# EAGLE board CubePCB (EAGLE 8.3.2), part 1 of 2
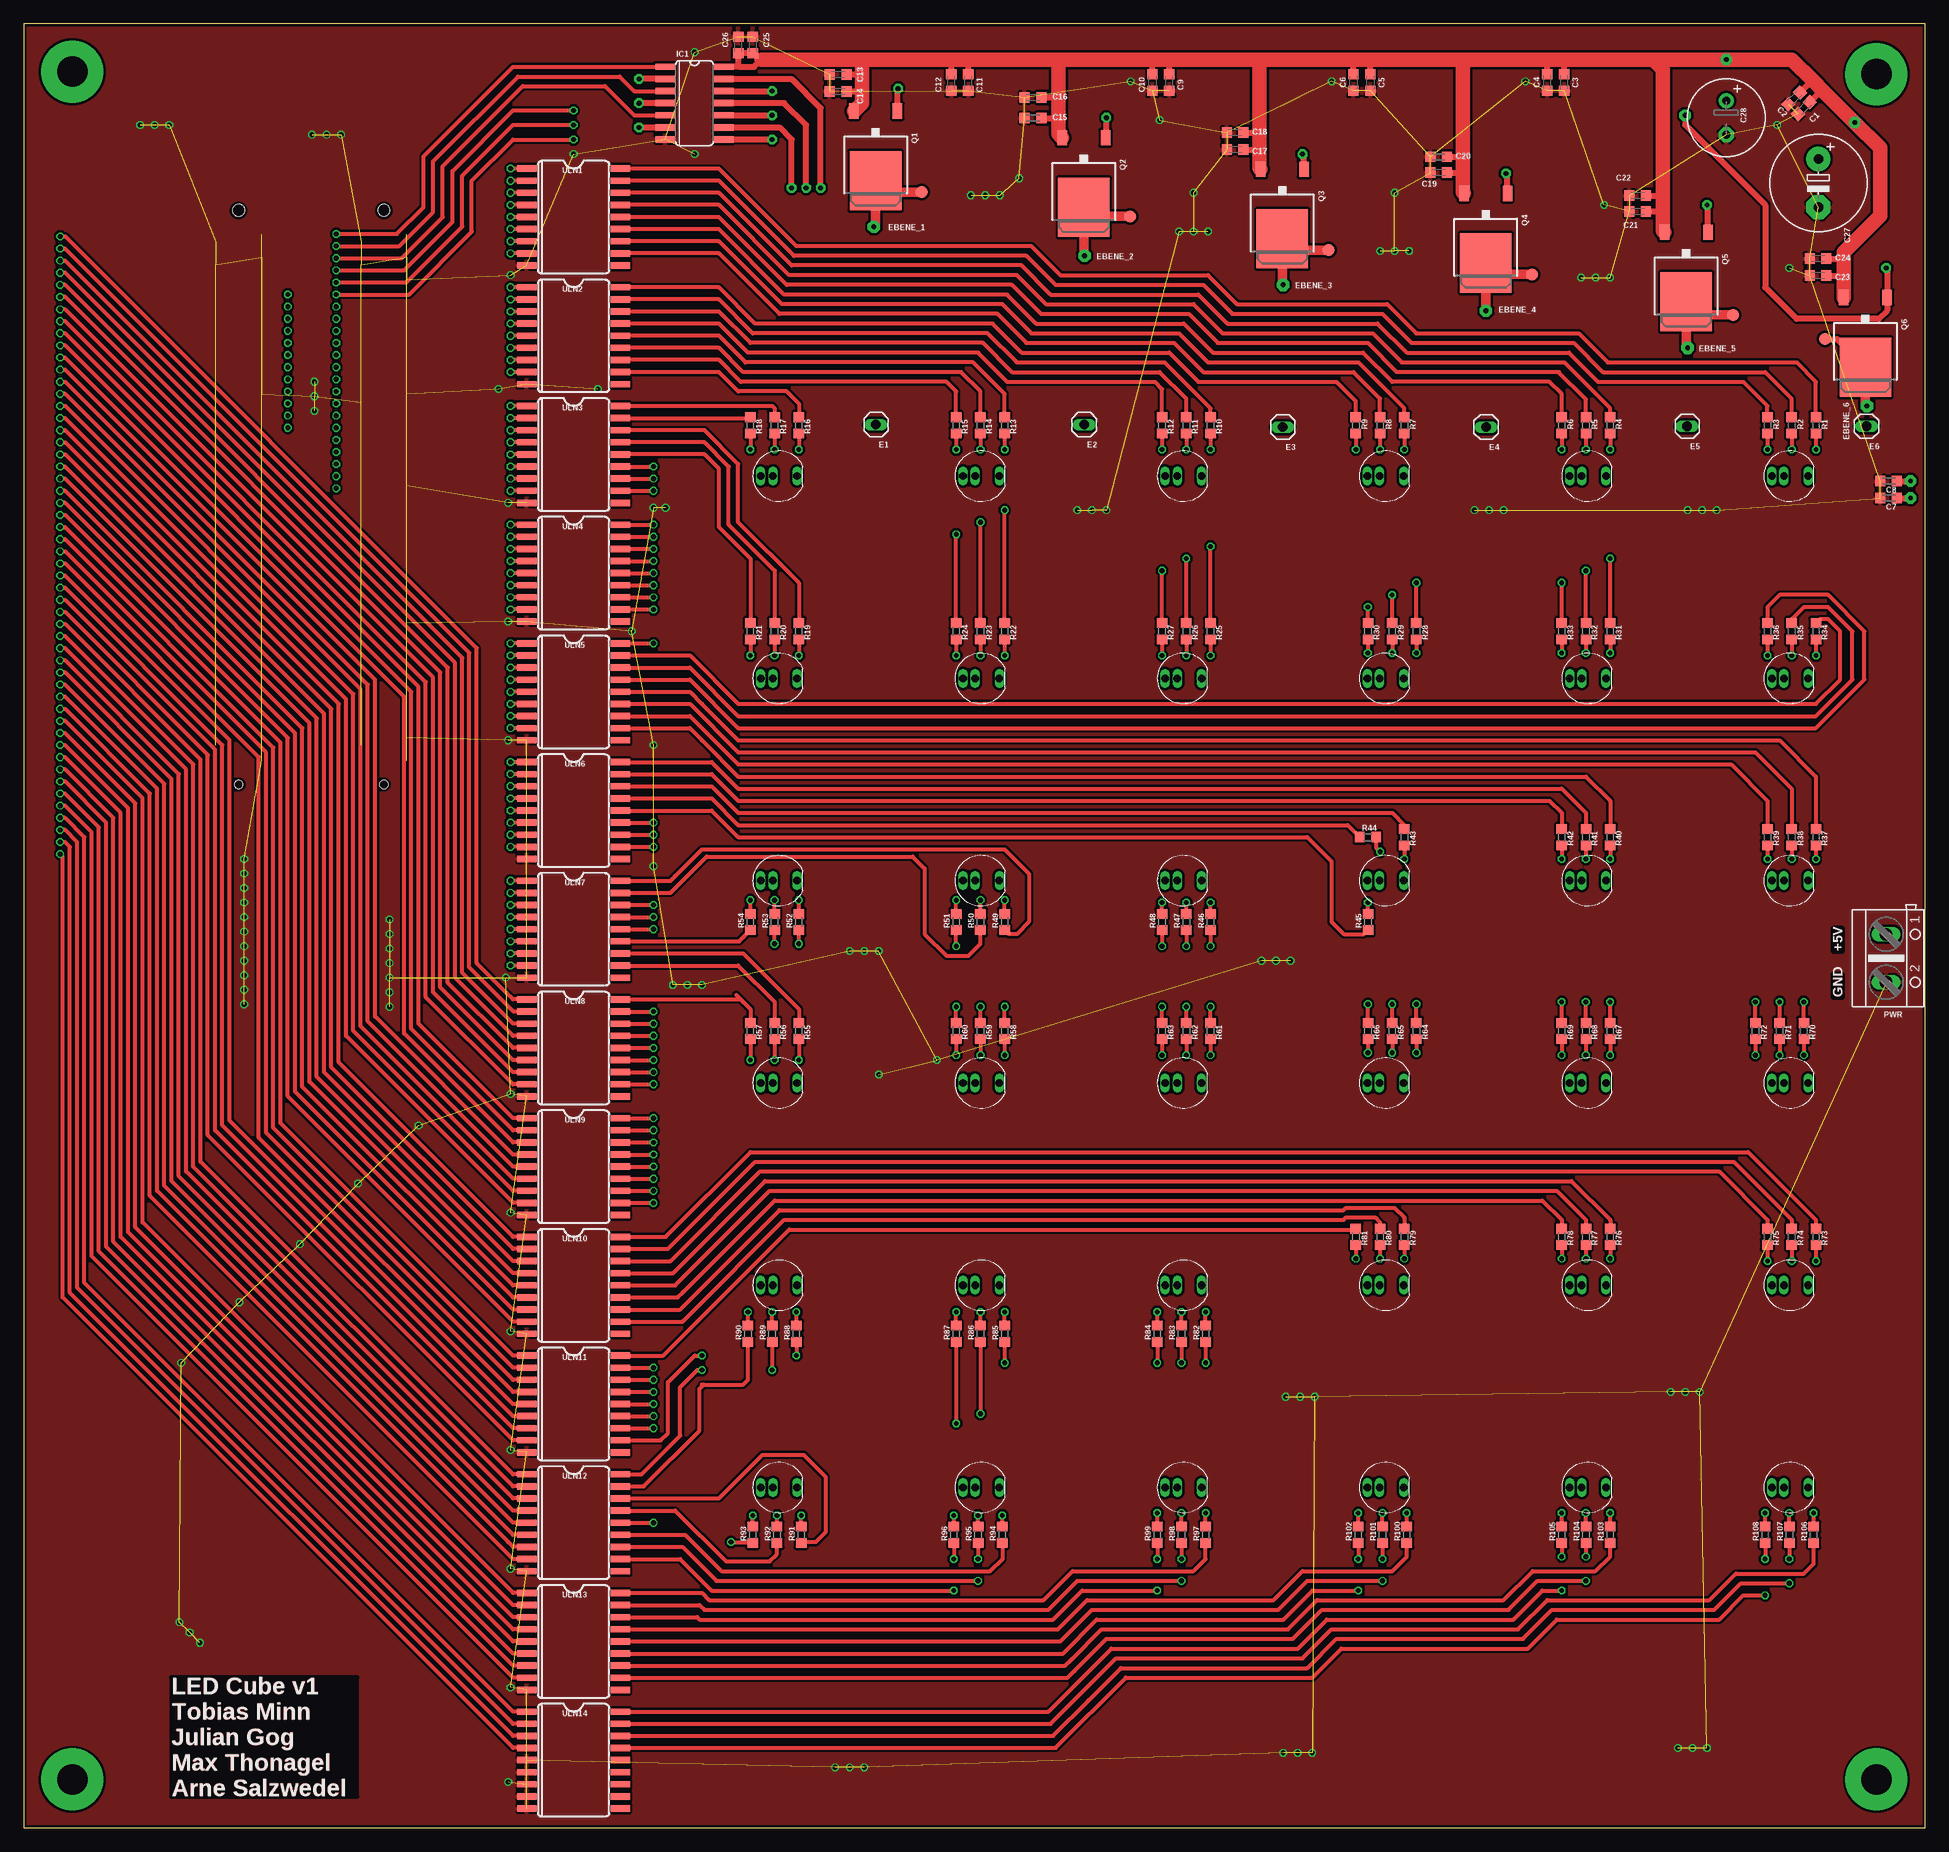
[diagram p4: board, top side]
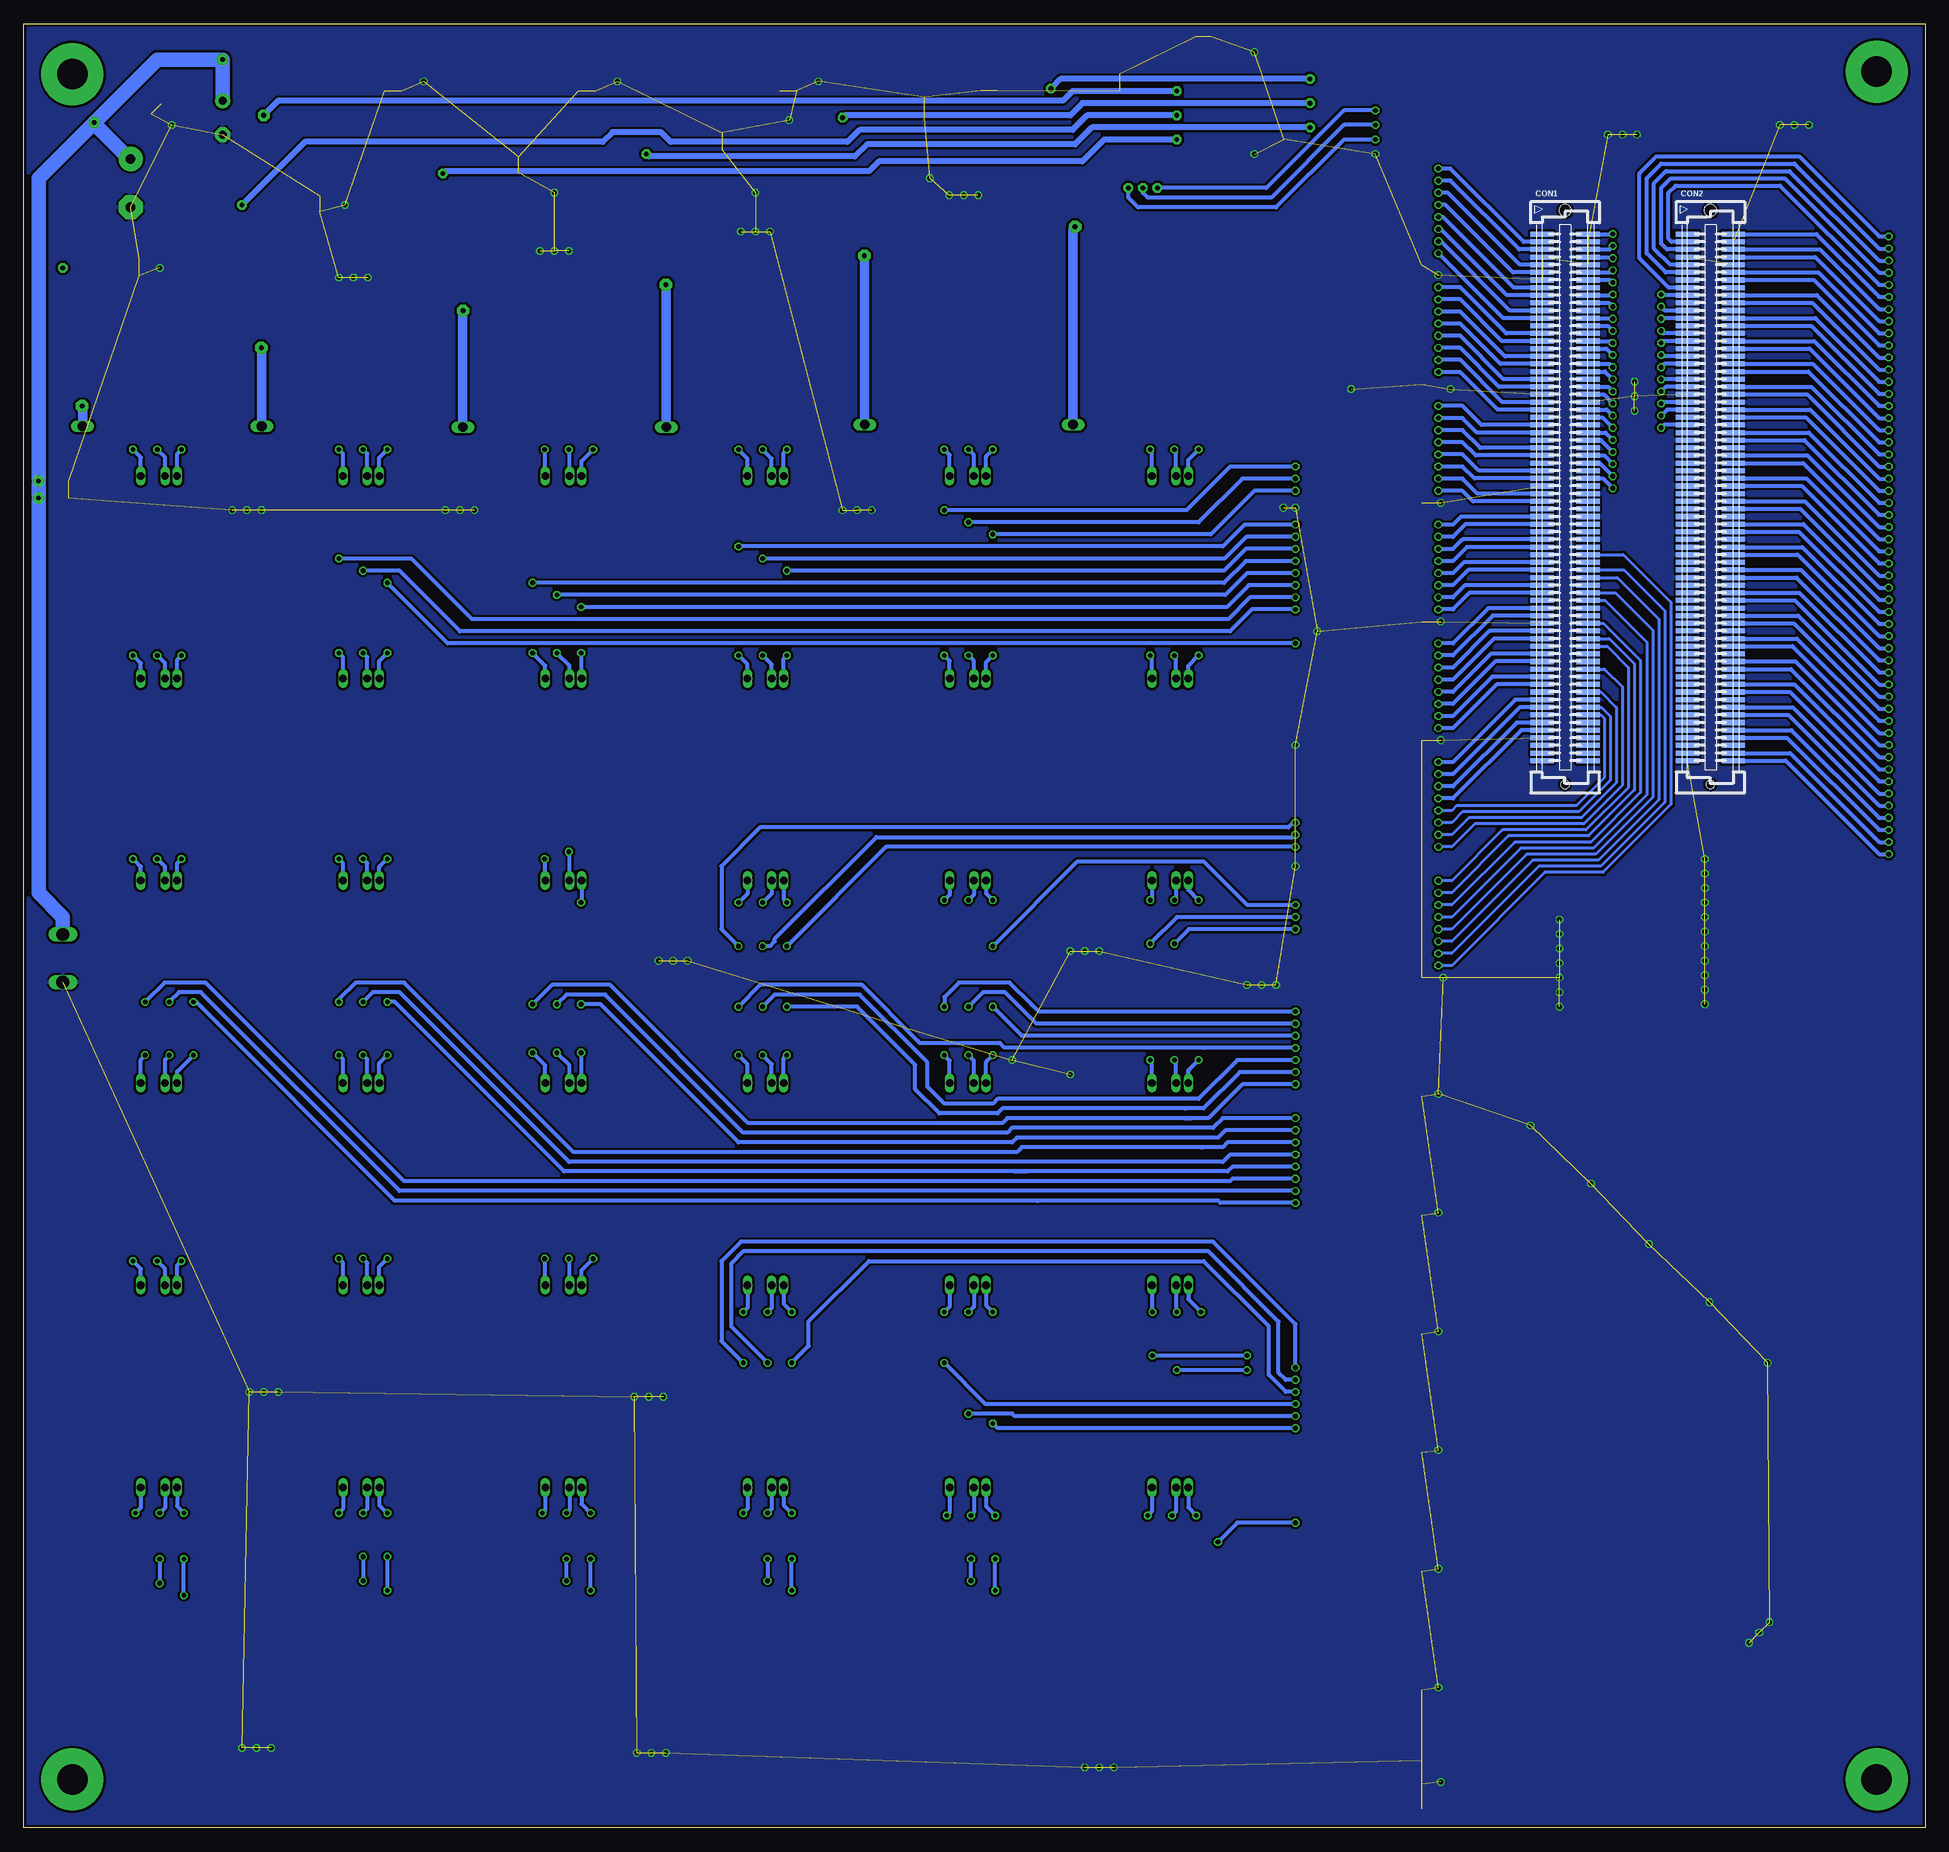
[diagram p5: board, bottom side, seen from below]

Size 199.41 x 189.17 mm. Coordinates in mm from the lower left corner, seen from the top.
Outline: 0,0 199.41,0 199.41,189.17 0,189.17 0,0
Copper layers (1*16): Top 0.035mm / dielectric 1.5mm / Bottom 0.035mm
Design rules "PCB-POOL Standard_editM *": minimum track width 0.15mm, minimum drill 0.3mm, track to track 0.15mm, track to pad 0.15mm, pad to pad 0.15mm, via to via 0.15mm, smd to smd 0.15mm, copper to edge 0.3mm, drill to drill 0.2mm, minimum pad ring 0.1mm, minimum via ring 0.15mm, stop-mask expansion 0.075mm, vias tented up to drill 0mil, thermal gap 0.2mm

## Footprints (pad centres in the part's own frame; a part is rotated, then mirrored left to right if it is on the bottom)
C0603K = smd 1.05 x 1.08: 1 -0.875,0; 2 0.875,0
E5-10,5 = drill 1.016 pad 2.54: + -2.54,0 | drill 1.016 pad 2.54 octagon: - 2.54,0
E3,5-8 = drill 0.813 pad 1.6: + -1.778,0 | drill 0.813 pad 1.6 octagon: - 1.778,0
140-FH0.8 = smd 0.53 x 2.45: P$1 -26.8,-2.4; P$2 -26,-2.4; P$3 -25.2,-2.4; P$4 -24.4,-2.4; P$5 -23.6,-2.4; P$6 -22.8,-2.4; P$7 -22,-2.4; P$8 -21.2,-2.4; P$9 -20.4,-2.4; P$10 -19.6,-2.4; P$11 -18.8,-2.4; P$12 -18,-2.4; P$13 -17.2,-2.4; P$14 -16.4,-2.4; P$15 -15.6,-2.4; P$16 -14.8,-2.4; P$17 -14,-2.4; P$18 -13.2,-2.4; P$19 -12.4,-2.4; P$20 -11.6,-2.4; P$21 -10.8,-2.4; P$22 -10,-2.4; P$23 -9.2,-2.4; P$24 -8.4,-2.4; P$25 -7.6,-2.4; P$26 -6.8,-2.4; P$27 -6,-2.4; P$28 -5.2,-2.4; P$29 -4.4,-2.4; P$30 -3.6,-2.4; P$31 -2.8,-2.4; P$32 -2,-2.4; P$33 -1.2,-2.4; P$34 -0.4,-2.4; P$35 0.4,-2.4; P$36 1.2,-2.4; P$37 2,-2.4; P$38 2.8,-2.4; P$39 3.6,-2.4; P$40 4.4,-2.4; P$41 5.2,-2.4; P$42 6,-2.4; P$43 6.8,-2.4; P$44 7.6,-2.4; P$45 8.4,-2.4; P$46 9.2,-2.4; P$47 10,-2.4; P$48 10.8,-2.4; P$49 11.6,-2.4; P$50 12.4,-2.4; P$51 13.2,-2.4; P$52 14,-2.4; P$53 14.8,-2.4; P$54 15.6,-2.4; P$55 16.4,-2.4; P$56 17.2,-2.4; P$57 18,-2.4; P$58 18.8,-2.4; P$59 19.6,-2.4; P$60 20.4,-2.4; P$61 21.2,-2.4; P$62 22,-2.4; P$63 22.8,-2.4; P$64 23.6,-2.4; P$65 24.4,-2.4; P$66 25.2,-2.4; P$67 26,-2.4; P$68 26.8,-2.4; P$69 27.6,-2.4; P$70 28.4,-2.4; P$71 -26.8,2.4; P$72 -26,2.4; P$73 -25.2,2.4; P$74 -24.4,2.4; P$75 -23.6,2.4; P$76 -22.8,2.4; P$77 -22,2.4; P$78 -21.2,2.4; P$79 -20.4,2.4; P$80 -19.6,2.4; P$81 -18.8,2.4; P$82 -18,2.4; P$83 -17.2,2.4; P$84 -16.4,2.4; P$85 -15.6,2.4; P$86 -14.8,2.4; P$87 -14,2.4; P$88 -13.2,2.4; P$89 -12.4,2.4; P$90 -11.6,2.4; P$91 -10.8,2.4; P$92 -10,2.4; P$93 -9.2,2.4; P$94 -8.4,2.4; P$95 -7.6,2.4; P$96 -6.8,2.4; P$97 -6,2.4; P$98 -5.2,2.4; P$99 -4.4,2.4; P$100 -3.6,2.4; P$101 -2.8,2.4; P$102 -2,2.4; P$103 -1.2,2.4; P$104 -0.4,2.4; P$105 0.4,2.4; P$106 1.2,2.4; P$107 2,2.4; P$108 2.8,2.4; P$109 3.6,2.4; P$110 4.4,2.4; P$111 5.2,2.4; P$112 6,2.4; P$113 6.8,2.4; P$114 7.6,2.4; P$115 8.4,2.4; P$116 9.2,2.4; P$117 10,2.4; P$118 10.8,2.4; P$119 11.6,2.4; P$120 12.4,2.4; P$121 13.2,2.4; P$122 14,2.4; P$123 14.8,2.4; P$124 15.6,2.4; P$125 16.4,2.4; P$126 17.2,2.4; P$127 18,2.4; P$128 18.8,2.4; P$129 19.6,2.4; P$130 20.4,2.4; P$131 21.2,2.4; P$132 22,2.4; P$133 22.8,2.4; P$134 23.6,2.4; P$135 24.4,2.4; P$136 25.2,2.4; P$137 26,2.4; P$138 26.8,2.4; P$139 27.6,2.4; P$140 28.4,2.4 | hole 0.85: 30.9,0 | hole 1.25: -29.3,0
1X01 = drill 1.016 long: 1 0,0
B1,27 = smd 1.27 x 1.27: TP 0,0
SO14 = smd 0.66 x 2.032: 1 -3.81,-3.073; 2 -2.54,-3.073; 3 -1.27,-3.073; 4 0,-3.073; 5 1.27,-3.073; 6 2.54,-3.073; 7 3.81,-3.073; 8 3.81,3.073; 9 2.54,3.073; 10 1.27,3.073; 11 0,3.073; 12 -1.27,3.073; 13 -2.54,3.073; 14 -3.81,3.073
AK500/2 = drill 1.321 long: 1 -2.515,0; 2 2.515,0
TO252 = smd 1 x 1.6: 1 -2.28,-4.8; 2 2.28,-4.8 | smd 5.4 x 6.2: 3 0,2.5
R0603 = smd 1 x 1.1: 1 -0.85,0; 2 0.85,0
LED-RGB-WO-ANODE = drill 0.8 pad 0.914 long: B -0.635,0; G -1.905,0; R 1.905,0
SO18L = smd 0.66 x 2.032: 1 -0.635,-4.902; 2 0.635,-4.902; 3 1.905,-4.902; 4 3.175,-4.902; 5 4.445,-4.902; 6 5.715,-4.902; 7 6.985,-4.902; 8 8.255,-4.902; 9 9.525,-4.902; 10 9.525,4.902; 11 8.255,4.902; 12 6.985,4.902; 13 5.715,4.902; 14 4.445,4.902; 15 3.175,4.902; 16 1.905,4.902; 17 0.635,4.902; 18 -0.635,4.902

## Placement (x,y rotation side)
C1  100nF  [C0603K]  186.69,180.34 225 top
C2  100nF  [C0603K]  185.67,181.36 225 top
C3  10uF  [C0603K]  161.54,183.01 270 top
C4  100nF  [C0603K]  159.77,183.01 270 top
C5  100nF  [C0603K]  141.22,183.01 270 top
C6  100nF  [C0603K]  139.45,183.01 270 top
C7  10uF  [C0603K]  195.58,139.45 180 top
C8  10uF  [C0603K]  195.58,141.22 180 top
C9  100nF  [C0603K]  120.14,183.01 270 top
C10  10uF  [C0603K]  118.36,183.01 270 top
C11  100nF  [C0603K]  99.06,183.01 270 top
C12  10uF  [C0603K]  97.28,183.01 270 top
C13  100nF  [C0603K]  85.39,183.86 180 top
C14  10uF  [C0603K]  85.39,182.08 180 top
C15  100nF  [C0603K]  105.84,179.28 180 top
C16  10uF  [C0603K]  105.84,181.44 180 top
C17  100nF  [C0603K]  127.05,175.98 180 top
C18  10uF  [C0603K]  127.05,177.76 180 top
C19  100nF  [C0603K]  148.38,173.57 180 top
C20  10uF  [C0603K]  148.38,175.22 180 top
C21  100nF  [C0603K]  169.26,169.5 180 top
C22  10uF  [C0603K]  169.26,171.15 180 top
C23  100nF  [C0603K]  188.19,162.77 180 top
C24  10uF  [C0603K]  188.19,164.55 180 top
C25  10uF  [C0603K]  76.45,186.94 90 top
C26  100nF  [C0603K]  74.93,186.94 90 top
C27  1000uF  [E5-10,5]  188.21,172.47 270 top
C28  330uF  [E3,5-8]  178.56,179.32 270 top
CON1  P1  [140-FH0.8]  37.76,140.31 270 bottom
CON2  P2  [140-FH0.8]  22.52,140.31 270 bottom
E1  [1X01]  89.37,147.15 180 top
E2  [1X01]  111.21,147.15 180 top
E3  [1X01]  132.04,146.89 180 top
E4  [1X01]  153.38,146.89 180 top
E5  [1X01]  174.46,146.97 180 top
E6  [1X01]  193.25,146.97 180 top
EBENE_1  TPB1,27  [B1,27]  94.19,171.53 90 top
EBENE_2  TPB1,27  [B1,27]  116.04,168.99 90 top
EBENE_3  TPB1,27  [B1,27]  136.87,165.43 90 top
EBENE_4  TPB1,27  [B1,27]  158.2,162.89 90 top
EBENE_5  TPB1,27  [B1,27]  179.28,158.65 90 top
EBENE_6  TPB1,27  [B1,27]  188.93,156.11 90 top
IC1  74HCT04D  [SO14]  70.33,180.85 270 top
PWR  [AK500/2]  195.33,91.19 270 top
Q1  IRLR9343  [TO252]  89.33,175.22 180 top
Q2  IRLR9343  [TO252]  111.17,172.43 180 top
Q3  IRLR9343  [TO252]  132,169.12 180 top
Q4  IRLR9343  [TO252]  153.34,166.58 180 top
Q5  IRLR9343  [TO252]  174.34,162.52 180 top
Q6  IRLR9343  [TO252]  193.14,155.66 180 top
R1  [R0603]  187.96,147.07 270 top
R2  [R0603]  185.42,147.07 270 top
R3  [R0603]  182.88,147.07 270 top
R4  [R0603]  166.37,147.07 270 top
R5  [R0603]  163.83,147.07 270 top
R6  [R0603]  161.29,147.07 270 top
R7  [R0603]  144.78,147.07 270 top
R8  [R0603]  142.24,147.07 270 top
R9  [R0603]  139.7,147.07 270 top
R10  [R0603]  124.46,147.07 270 top
R11  [R0603]  121.92,147.07 270 top
R12  [R0603]  119.38,147.07 270 top
R13  [R0603]  102.87,147.07 270 top
R14  [R0603]  100.33,147.07 270 top
R15  [R0603]  97.79,147.07 270 top
R16  [R0603]  81.28,147.07 270 top
R17  [R0603]  78.74,147.07 270 top
R18  [R0603]  76.2,147.07 270 top
R19  [R0603]  81.28,125.48 270 top
R20  [R0603]  78.74,125.48 270 top
R21  [R0603]  76.2,125.48 270 top
R22  [R0603]  102.87,125.48 270 top
R23  [R0603]  100.33,125.48 270 top
R24  [R0603]  97.79,125.48 270 top
R25  [R0603]  124.46,125.48 270 top
R26  [R0603]  121.92,125.48 270 top
R27  [R0603]  119.38,125.48 270 top
R28  [R0603]  146.05,125.48 270 top
R29  [R0603]  143.51,125.48 270 top
R30  [R0603]  140.97,125.48 270 top
R31  [R0603]  166.37,125.48 270 top
R32  [R0603]  163.83,125.48 270 top
R33  [R0603]  161.29,125.48 270 top
R34  [R0603]  187.96,125.48 270 top
R35  [R0603]  185.42,125.48 270 top
R36  [R0603]  182.88,125.48 270 top
R37  [R0603]  187.96,103.89 270 top
R38  [R0603]  185.42,103.89 270 top
R39  [R0603]  182.88,103.89 270 top
R40  [R0603]  166.37,103.89 270 top
R41  [R0603]  163.83,103.89 270 top
R42  [R0603]  161.29,103.89 270 top
R43  [R0603]  144.78,103.89 270 top
R44  [R0603]  140.97,103.89 0 top
R45  [R0603]  140.97,95 90 top
R46  [R0603]  124.46,95 90 top
R47  [R0603]  121.92,95 90 top
R48  [R0603]  119.38,95 90 top
R49  [R0603]  102.87,95 90 top
R50  [R0603]  100.33,95 90 top
R51  [R0603]  97.79,95 90 top
R52  [R0603]  81.28,95 90 top
R53  [R0603]  78.74,95 90 top
R54  [R0603]  76.2,95 90 top
R55  [R0603]  81.28,83.57 270 top
R56  [R0603]  78.74,83.57 270 top
R57  [R0603]  76.2,83.57 270 top
R58  [R0603]  102.87,83.57 270 top
R59  [R0603]  100.33,83.57 270 top
R60  [R0603]  97.79,83.57 270 top
R61  [R0603]  124.46,83.57 270 top
R62  [R0603]  121.92,83.57 270 top
R63  [R0603]  119.38,83.57 270 top
R64  [R0603]  146.05,83.57 270 top
R65  [R0603]  143.51,83.57 270 top
R66  [R0603]  140.97,83.57 270 top
R67  [R0603]  166.37,83.57 270 top
R68  [R0603]  163.83,83.57 270 top
R69  [R0603]  161.29,83.57 270 top
R70  [R0603]  186.69,83.57 270 top
R71  [R0603]  184.15,83.57 270 top
R72  [R0603]  181.61,83.57 270 top
R73  [R0603]  187.96,61.98 270 top
R74  [R0603]  185.42,61.98 270 top
R75  [R0603]  182.88,61.98 270 top
R76  [R0603]  166.37,61.98 270 top
R77  [R0603]  163.83,61.98 270 top
R78  [R0603]  161.29,61.98 270 top
R79  [R0603]  144.78,61.98 270 top
R80  [R0603]  142.24,61.98 270 top
R81  [R0603]  139.7,61.98 270 top
R82  [R0603]  123.95,51.82 90 top
R83  [R0603]  121.41,51.82 90 top
R84  [R0603]  118.87,51.82 90 top
R85  [R0603]  102.87,51.82 90 top
R86  [R0603]  100.33,51.82 90 top
R87  [R0603]  97.79,51.82 90 top
R88  [R0603]  81.03,51.82 90 top
R89  [R0603]  78.49,51.82 90 top
R90  [R0603]  75.95,51.82 90 top
R91  [R0603]  81.53,30.73 90 top
R92  [R0603]  78.99,30.73 90 top
R93  [R0603]  76.45,30.73 90 top
R94  [R0603]  102.62,30.73 90 top
R95  [R0603]  100.08,30.73 90 top
R96  [R0603]  97.54,30.73 90 top
R97  [R0603]  123.95,30.73 90 top
R98  [R0603]  121.41,30.73 90 top
R99  [R0603]  118.87,30.73 90 top
R100  [R0603]  145.03,30.73 90 top
R101  [R0603]  142.49,30.73 90 top
R102  [R0603]  139.95,30.73 90 top
R103  [R0603]  166.37,30.73 90 top
R104  [R0603]  163.83,30.73 90 top
R105  [R0603]  161.29,30.73 90 top
R106  [R0603]  187.71,30.73 90 top
R107  [R0603]  185.17,30.73 90 top
R108  [R0603]  182.63,30.73 90 top
RGB1  LED-RGB-CA-ANODE-SPLIT  [LED-RGB-WO-ANODE]  185.24,141.75 0 top
RGB2  LED-RGB-CA-ANODE-SPLIT  [LED-RGB-WO-ANODE]  164.03,141.75 0 top
RGB3  LED-RGB-CA-ANODE-SPLIT  [LED-RGB-WO-ANODE]  142.82,141.75 0 top
RGB4  LED-RGB-CA-ANODE-SPLIT  [LED-RGB-WO-ANODE]  121.61,141.75 0 top
RGB5  LED-RGB-CA-ANODE-SPLIT  [LED-RGB-WO-ANODE]  100.4,141.75 0 top
RGB6  LED-RGB-CA-ANODE-SPLIT  [LED-RGB-WO-ANODE]  79.19,141.75 0 top
RGB7  LED-RGB-CA-ANODE-SPLIT  [LED-RGB-WO-ANODE]  79.19,120.54 0 top
RGB8  LED-RGB-CA-ANODE-SPLIT  [LED-RGB-WO-ANODE]  100.4,120.54 0 top
RGB9  LED-RGB-CA-ANODE-SPLIT  [LED-RGB-WO-ANODE]  121.61,120.54 0 top
RGB10  LED-RGB-CA-ANODE-SPLIT  [LED-RGB-WO-ANODE]  142.82,120.54 0 top
RGB11  LED-RGB-CA-ANODE-SPLIT  [LED-RGB-WO-ANODE]  164.03,120.54 0 top
RGB12  LED-RGB-CA-ANODE-SPLIT  [LED-RGB-WO-ANODE]  185.24,120.54 0 top
RGB13  LED-RGB-CA-ANODE-SPLIT  [LED-RGB-WO-ANODE]  185.24,99.33 0 top
RGB14  LED-RGB-CA-ANODE-SPLIT  [LED-RGB-WO-ANODE]  164.03,99.33 0 top
RGB15  LED-RGB-CA-ANODE-SPLIT  [LED-RGB-WO-ANODE]  142.82,99.33 0 top
RGB16  LED-RGB-CA-ANODE-SPLIT  [LED-RGB-WO-ANODE]  121.61,99.33 0 top
RGB17  LED-RGB-CA-ANODE-SPLIT  [LED-RGB-WO-ANODE]  100.4,99.33 0 top
RGB18  LED-RGB-CA-ANODE-SPLIT  [LED-RGB-WO-ANODE]  79.19,99.33 0 top
RGB19  LED-RGB-CA-ANODE-SPLIT  [LED-RGB-WO-ANODE]  79.19,78.12 0 top
RGB20  LED-RGB-CA-ANODE-SPLIT  [LED-RGB-WO-ANODE]  100.4,78.12 0 top
RGB21  LED-RGB-CA-ANODE-SPLIT  [LED-RGB-WO-ANODE]  121.61,78.12 0 top
RGB22  LED-RGB-CA-ANODE-SPLIT  [LED-RGB-WO-ANODE]  142.82,78.12 0 top
RGB23  LED-RGB-CA-ANODE-SPLIT  [LED-RGB-WO-ANODE]  164.03,78.12 0 top
RGB24  LED-RGB-CA-ANODE-SPLIT  [LED-RGB-WO-ANODE]  185.24,78.12 0 top
RGB25  LED-RGB-CA-ANODE-SPLIT  [LED-RGB-WO-ANODE]  185.24,56.91 0 top
RGB26  LED-RGB-CA-ANODE-SPLIT  [LED-RGB-WO-ANODE]  164.03,56.91 0 top
RGB27  LED-RGB-CA-ANODE-SPLIT  [LED-RGB-WO-ANODE]  142.82,56.91 0 top
RGB28  LED-RGB-CA-ANODE-SPLIT  [LED-RGB-WO-ANODE]  121.61,56.91 0 top
RGB29  LED-RGB-CA-ANODE-SPLIT  [LED-RGB-WO-ANODE]  100.4,56.91 0 top
RGB30  LED-RGB-CA-ANODE-SPLIT  [LED-RGB-WO-ANODE]  79.19,56.91 0 top
RGB31  LED-RGB-CA-ANODE-SPLIT  [LED-RGB-WO-ANODE]  79.19,35.7 0 top
RGB32  LED-RGB-CA-ANODE-SPLIT  [LED-RGB-WO-ANODE]  100.4,35.7 0 top
RGB33  LED-RGB-CA-ANODE-SPLIT  [LED-RGB-WO-ANODE]  121.61,35.7 0 top
RGB34  LED-RGB-CA-ANODE-SPLIT  [LED-RGB-WO-ANODE]  142.82,35.7 0 top
RGB35  LED-RGB-CA-ANODE-SPLIT  [LED-RGB-WO-ANODE]  164.03,35.7 0 top
RGB36  LED-RGB-CA-ANODE-SPLIT  [LED-RGB-WO-ANODE]  185.24,35.7 0 top
ULN1  [SO18L]  57.66,173.35 270 top
ULN2  [SO18L]  57.66,160.91 270 top
ULN3  [SO18L]  57.66,148.46 270 top
ULN4  [SO18L]  57.66,136.02 270 top
ULN5  [SO18L]  57.66,123.57 270 top
ULN6  [SO18L]  57.66,111.12 270 top
ULN7  [SO18L]  57.66,98.68 270 top
ULN8  [SO18L]  57.66,86.23 270 top
ULN9  [SO18L]  57.66,73.79 270 top
ULN10  [SO18L]  57.66,61.34 270 top
ULN11  [SO18L]  57.66,48.9 270 top
ULN12  [SO18L]  57.66,36.45 270 top
ULN13  [SO18L]  57.66,24 270 top
ULN14  [SO18L]  57.66,11.56 270 top

## Tracks (layer width: path | path; a pad name or v marks a point on that pad's centre or on a via)
3V3_FPGA_P1  (5 unrouted)
3V3_FPGA_P2  (5 unrouted)
5V_FPGA_P1  (5 unrouted)
5V_FPGA_P2  (5 unrouted)
+5V  (via drill 0.5 pad 1.2)
  Top 0.61: 171.96,172.72 171.91,172.68 | 77.47,185.31 77.36,185.42 | 86.65,185.3 86.53,185.42 | 108.03,185.42 108.49,184.96 | 129.54,179.58 129.57,179.54 | 150.88,177.29 150.91,177.26 | C12.1 97.28,185.34 97.36,185.42 | C11.1 99.06,185.36 99,185.42 | C10.1 118.36,185.28 118.23,185.42 | C9.1 120.14,185.4 120.12,185.42 | C6.1 139.45,185.42 | C5.1 141.22,185.35 141.16,185.42 | C4.1 159.77,185.2 159.54,185.42 | C3.1 161.54,185.32 161.45,185.42 | 75.12,184.66 IC1.14 | 75.12,184.66 76.61,184.66 77.36,185.42 | 187.71,183.13 187.45,183.13 C2.1 | 188.72,182.12 188.47,182.12 C1.1 | C8.1 v197.87,141.22 | C7.1 v197.87,139.45 | 77.22,185.57 77.36,185.42 | C16.1 108.4,181.44 108.49,181.35 | C15.1 108.49,179.28 | C13.1 87.85,183.86 87.88,183.89 | C14.1 87.81,182.08 87.88,182.15 | C18.1 129.48,177.76 129.57,177.85 | C17.1 129.54,175.98 129.57,175.95 | C20.1 150.88,175.22 150.91,175.19 | C19.1 150.84,173.57 150.91,173.5 | C22.1 171.84,171.15 171.91,171.08 | C21.1 171.8,169.5 171.91,169.62 | C24.1 190.2,164.55 190.86,165.2 | C23.1 190.83,162.77 190.86,162.8 | C25.1 C26.1 74.93,184.85 75.12,184.66
  Top 1.016: 150.91,185.02 150.51,185.42 | 129.57,185.11 129.26,185.42
  Top 1.524: 77.36,185.42 86.53,185.42 87.88,185.42 | 87.88,185.42 97.36,185.42 99,185.42 108.03,185.42 118.23,185.42 120.12,185.42 129.26,185.42 139.45,185.42 141.16,185.42 150.51,185.42 159.54,185.42 161.45,185.42 170.9,185.42 | 150.91,185.02 150.91,177.26 150.91,175.19 150.91,173.5 150.91,171.53 Q4.2 | 170.9,185.42 171.91,184.4 171.91,172.68 171.91,171.08 171.91,169.62 171.91,167.47 Q5.2 | 129.57,185.11 129.57,179.54 129.57,177.85 129.57,175.95 129.57,174.07 Q3.2 | 170.9,185.42 v178.56,185.42 185.42,185.42 187.71,183.13 188.72,182.12 v192.03,178.81 194.69,176.15 194.69,169.04 190.86,165.2 190.86,162.8 Q6.2 | 108.49,184.96 108.49,181.35 108.49,179.28 108.49,177.63 Q2.2 | 87.88,185.42 87.88,183.89 87.88,182.15 87.88,180.86 Q1.2
  Bottom 1.016: 192.1,178.74 v192.03,178.81 | v178.56,185.42 | C27.+ 188.37,175.01
  Bottom 1.524: PWR.1 195.33,95.5 197.87,98.04 v197.87,139.45 v197.87,141.22 197.87,172.97 192.1,178.74 188.37,175.01 | v192.03,178.81 185.42,185.42 v178.56,185.42 | C28.+ v178.56,185.42
B1  (via drill 0.5 pad 0.8)
  Top 0.406: ULN1.2 v51.05,172.72
  Bottom 0.406: v51.05,172.72 49.78,172.72 42.57,165.51 CON1.P$3
B2  (via drill 0.5 pad 0.8)
  Top 0.406: ULN1.5 v51.05,168.91
  Bottom 0.406: v51.05,168.91 50.55,168.91 43.14,161.51 CON1.P$8
B3  (via drill 0.5 pad 0.8)
  Top 0.406: ULN1.8 v51.05,165.1
  Bottom 0.406: CON1.P$12 44.26,158.31 v51.05,165.1
B4  (via drill 0.5 pad 0.8)
  Top 0.406: ULN2.3 v51.05,159
  Bottom 0.406: CON1.P$17 44.07,154.31 48.77,159 v51.05,159
B5  (via drill 0.5 pad 0.8)
  Top 0.406: ULN2.6 v51.05,155.19
  Bottom 0.406: 50.8,155.19 v51.05,155.19 48.77,155.19 44.68,151.11 CON1.P$21
B6  (via drill 0.5 pad 0.8)
  Top 0.406: ULN3.1 v51.05,149.1
  Bottom 0.406: CON1.P$26 46.52,147.11 48.51,149.1 v51.05,149.1
B7  (via drill 0.5 pad 0.8)
  Top 0.406: ULN3.4 v51.05,145.29
  Bottom 0.406: CON1.P$30 47.13,143.91 48.51,145.29 v51.05,145.29
B8  (via drill 0.5 pad 0.8)
  Top 0.406: ULN3.7 v51.05,141.48
  Bottom 0.406: 50.8,141.48 v51.05,141.48 48.51,141.48 46.94,139.91 CON1.P$35
B9  (via drill 0.5 pad 0.8)
  Top 0.406: ULN4.2 v51.05,135.38
  Bottom 0.406: CON1.P$39 48.2,136.71 49.53,135.38 v51.05,135.38
B10  (via drill 0.5 pad 0.8)
  Top 0.406: ULN4.5 v51.05,131.57
  Bottom 0.406: CON1.P$44 48.39,132.71 49.53,131.57 v51.05,131.57
B11  (via drill 0.5 pad 0.8)
  Top 0.406: ULN4.8 v51.05,127.76
  Bottom 0.406: CON1.P$48 47.78,129.51 49.53,127.76 v51.05,127.76
B12  (via drill 0.5 pad 0.8)
  Top 0.406: ULN5.3 v51.05,121.67
  Bottom 0.406: CON1.P$53 45.69,125.51 49.53,121.67 v51.05,121.67
B13  (via drill 0.5 pad 0.8)
  Top 0.406: ULN5.6 v51.05,117.86
  Bottom 0.406: CON1.P$57 45.08,122.31 49.53,117.86 v51.05,117.86
B14  (via drill 0.5 pad 0.8)
  Top 0.406: ULN6.1 v51.05,111.76
  Bottom 0.406: CON1.P$62 42.98,118.31 49.53,111.76 v51.05,111.76
B15  (via drill 0.5 pad 0.8)
  Top 0.406: ULN6.4 v51.05,107.95
  Bottom 0.406: CON1.P$66 42.37,115.11 49.53,107.95 v51.05,107.95
B16  (via drill 0.5 pad 0.8)
  Top 0.406: ULN6.7 v51.05,104.14
  Bottom 0.305: CON1.P$131 34.02,119.11 32.38,117.47 32.38,109.6 36.07,105.92 47.88,105.92 49.66,104.14 v51.05,104.14
B17  (via drill 0.5 pad 0.8)
  Top 0.406: ULN7.2 v51.05,98.04
  Bottom 0.305: CON1.P$124 33.14,124.71 30.48,122.05 30.48,108.84 35.31,104.01 43.69,104.01 49.66,98.04 v51.05,98.04
B18  (via drill 0.5 pad 0.8)
  Top 0.406: ULN7.5 v51.05,94.23
  Bottom 0.305: CON1.P$118 32.48,129.51 28.57,125.6 28.57,108.08 34.54,102.11 41.78,102.11 49.66,94.23 v51.05,94.23
B19  (via drill 0.5 pad 0.8)
  Top 0.406: ULN7.8 v51.05,90.42
  Bottom 0.305: CON1.P$113 31.65,133.51 26.67,128.52 26.67,107.31 33.78,100.2 39.88,100.2 49.66,90.42 v51.05,90.42
B20  (via drill 0.5 pad 0.8)
  Top 0.406: v3.81,164.34 4.32,164.34 45.97,122.68 45.97,89.66 51.31,84.33 ULN8.3
  Bottom 0.406: CON2.P$5 26.75,163.91 28.45,165.61 28.45,172.47 27.18,173.74 14.22,173.74 4.83,164.34 v3.81,164.34
B21  (via drill 0.5 pad 0.8)
  Top 0.406: v3.81,160.53 4.32,160.53 43.69,121.16 43.69,88.14 51.31,80.52 ULN8.6
  Bottom 0.406: CON2.P$71 11.41,167.11 4.83,160.53 v3.81,160.53
B22  (via drill 0.5 pad 0.8)
  Top 0.406: v3.81,156.72 4.32,156.72 41.4,119.63 41.4,84.33 51.31,74.42 ULN9.1
  Bottom 0.406: CON2.P$76 11.22,163.11 4.83,156.72 v3.81,156.72
B23  (via drill 0.5 pad 0.8)
  Top 0.406: v3.81,152.91 4.32,152.91 36.83,120.4 36.83,85.09 51.31,70.61 ULN9.4
  Bottom 0.406: CON2.P$80 11.83,159.91 4.83,152.91 v3.81,152.91
B24  (via drill 0.5 pad 0.8)
  Top 0.406: v3.81,149.1 4.32,149.1 34.54,118.87 34.54,83.57 51.31,66.8 ULN9.7
  Bottom 0.406: CON2.P$85 11.64,155.91 4.83,149.1 v3.81,149.1
B25  (via drill 0.5 pad 0.8)
  Top 0.406: v3.81,145.29 4.32,145.29 32.26,117.35 32.26,79.76 51.31,60.71 ULN10.2
  Bottom 0.406: CON2.P$89 12.25,152.71 4.83,145.29 v3.81,145.29
B26  (via drill 0.5 pad 0.8)
  Top 0.406: v3.81,141.48 4.32,141.48 29.97,115.82 29.97,78.23 51.31,56.9 ULN10.5
  Bottom 0.406: CON2.P$94 12.06,148.71 4.83,141.48 v3.81,141.48
B27  (via drill 0.5 pad 0.8)
  Top 0.406: v3.81,137.67 4.32,137.67 27.69,114.3 27.69,76.71 51.31,53.09 ULN10.8
  Bottom 0.406: CON2.P$98 12.67,145.51 4.83,137.67 v3.81,137.67
B28  (via drill 0.5 pad 0.8)
  Top 0.406: v3.81,133.86 4.32,133.86 25.4,112.78 25.4,72.9 51.31,46.99 ULN11.3
  Bottom 0.406: CON2.P$103 12.48,141.51 4.83,133.86 v3.81,133.86
B29  (via drill 0.5 pad 0.8)
  Top 0.406: v3.81,130.05 4.32,130.05 20.83,113.54 20.83,73.66 51.31,43.18 ULN11.6
  Bottom 0.406: CON2.P$107 13.09,138.31 4.83,130.05 v3.81,130.05
B30  (via drill 0.5 pad 0.8)
  Top 0.406: v3.81,126.24 4.32,126.24 18.54,112.01 18.54,69.85 51.31,37.08 ULN12.1
  Bottom 0.406: CON2.P$112 12.9,134.31 4.83,126.24 v3.81,126.24
B31  (via drill 0.5 pad 0.8)
  Top 0.406: v3.81,122.43 4.32,122.43 16.26,110.49 16.26,68.33 51.31,33.27 ULN12.4
  Bottom 0.406: CON2.P$116 13.51,131.11 4.83,122.43 v3.81,122.43
B32  (via drill 0.5 pad 0.8)
  Top 0.406: 50.77,30 50.83,29.94 | 50.77,30 13.97,66.8 13.97,108.97 4.32,118.62 v3.81,118.62 | ULN12.7 51.31,29.46 50.77,30
  Bottom 0.406: CON2.P$121 13.32,127.11 4.83,118.62 v3.81,118.62
B33  (via drill 0.5 pad 0.8)
  Top 0.406: v3.81,114.81 4.32,114.81 11.68,107.44 11.68,62.99 51.31,23.37 ULN13.2
  Bottom 0.406: CON2.P$125 13.93,123.91 4.83,114.81 v3.81,114.81
B34  (via drill 0.5 pad 0.8)
  Top 0.406: v3.81,111 4.32,111 9.4,105.92 9.4,61.47 51.31,19.56 ULN13.5
  Bottom 0.406: CON2.P$130 13.74,119.91 4.83,111 v3.81,111
B35  (via drill 0.5 pad 0.8)
  Top 0.406: v3.81,107.19 4.32,107.19 7.11,104.39 7.11,59.94 51.31,15.75 ULN13.8
  Bottom 0.406: CON2.P$134 14.35,116.71 4.83,107.19 v3.81,107.19
B36  (via drill 0.5 pad 0.8)
  Top 0.406: v3.81,103.38 4.32,103.38 4.83,102.87 4.83,56.13 51.31,9.65 ULN14.3
  Bottom 0.406: CON2.P$139 14.16,112.71 4.83,103.38 v3.81,103.38
EBENE_1  (via drill 0.5 pad 1.3)
  Top 1.016: v89.15,167.89 89.33,168.07 Q1.3 90.52,171.53 EBENE_1.TP
  Bottom 1.016: E1.1 89.37,167.68 v89.15,167.89
EBENE_2  (via drill 0.5 pad 1.3)
  Top 1.016: v111.25,164.85 111.17,164.93 Q2.3 112.11,168.99 EBENE_2.TP
  Bottom 1.016: E2.1 111.21,164.81 v111.25,164.85
EBENE_3  (via drill 0.5 pad 1.3)
  Top 1.016: v132.08,161.8 132,161.88 Q3.3 133.19,165.43 EBENE_3.TP
  Bottom 1.016: E3.1 132.04,161.76 v132.08,161.8
EBENE_4  (via drill 0.5 pad 1.3)
  Top 1.016: 153.42,159 v153.34,159.08 Q4.3 153.59,164.34 153.67,164.34 155.11,162.89 EBENE_4.TP
  Bottom 1.016: E4.1 153.38,158.96 153.42,159 v153.34,159.08
EBENE_5  (via drill 0.5 pad 1.3)
  Top 1.016: v174.5,155.19 174.34,155.35 Q5.3 175.71,158.65 EBENE_5.TP
  Bottom 1.016: E5.1 174.46,155.15 v174.5,155.19
EBENE_6  (via drill 0.5 pad 1.3)
  Top 0.61: EBENE_6.TP 190.19,156.11 Q6.3
  Top 1.016: Q6.3 193.14,149.25 v193.29,149.1
  Bottom 1.016: E6.1 193.25,149.06 v193.29,149.1
G1  (via drill 0.5 pad 0.8)
  Top 0.406: ULN1.3 v51.05,171.45
  Bottom 0.406: v51.05,171.45 50.04,171.45 42.5,163.91 CON1.P$5
G2  (via drill 0.5 pad 0.8)
  Top 0.406: ULN1.6 v51.05,167.64
  Bottom 0.406: v51.05,167.64 50.8,167.64 43.87,160.71 CON1.P$9
G3  (via drill 0.5 pad 0.8)
  Top 0.406: ULN2.1 v51.05,161.54
  Bottom 0.406: CON1.P$14 43.93,156.71 48.77,161.54 v51.05,161.54
G4  (via drill 0.5 pad 0.8)
  Top 0.406: ULN2.4 v51.05,157.73
  Bottom 0.406: 50.8,157.73 v51.05,157.73 48.77,157.73 44.54,153.51 CON1.P$18
G5  (via drill 0.5 pad 0.8)
  Top 0.406: ULN2.7 v51.05,153.92
  Bottom 0.406: 50.8,153.92 v51.05,153.92 48.77,153.92 44.35,149.51 CON1.P$23
G6  (via drill 0.5 pad 0.8)
  Top 0.406: ULN3.2 v51.05,147.83
  Bottom 0.406: CON1.P$27 46.99,146.31 48.51,147.83 v51.05,147.83
G7  (via drill 0.5 pad 0.8)
  Top 0.406: ULN3.5 v51.05,144.02
  Bottom 0.406: CON1.P$32 46.8,142.31 48.51,144.02 v51.05,144.02
G8  (via drill 0.5 pad 0.8)
  Top 0.406: ULN3.8 v51.05,140.21
  Bottom 0.406: CON1.P$36 47.41,139.11 48.51,140.21 v51.05,140.21
G9  (via drill 0.5 pad 0.8)
  Top 0.406: ULN4.3 v51.05,134.11
  Bottom 0.406: CON1.P$41 48.53,135.11 49.53,134.11 v51.05,134.11
G10  (via drill 0.5 pad 0.8)
  Top 0.406: ULN4.6 v51.05,130.3
  Bottom 0.406: CON1.P$45 47.92,131.91 49.53,130.3 v51.05,130.3
G11  (via drill 0.5 pad 0.8)
  Top 0.406: ULN5.1 v51.05,124.21
  Bottom 0.406: CON1.P$50 45.83,127.91 49.53,124.21 v51.05,124.21
G12  (via drill 0.5 pad 0.8)
  Top 0.406: ULN5.4 v51.05,120.4
  Bottom 0.406: CON1.P$54 45.22,124.71 49.53,120.4 v51.05,120.4
G13  (via drill 0.5 pad 0.8)
  Top 0.406: ULN5.7 v51.05,116.59
  Bottom 0.406: CON1.P$59 45.41,120.71 49.53,116.59 v51.05,116.59
G14  (via drill 0.5 pad 0.8)
  Top 0.406: ULN6.2 v51.05,110.49
  Bottom 0.406: CON1.P$63 42.51,117.51 49.53,110.49 v51.05,110.49
G15  (via drill 0.5 pad 0.8)
  Top 0.406: ULN6.5 v51.05,106.68
  Bottom 0.305: CON1.P$134 34.03,116.71 33.66,116.33 33.66,110.11 36.58,107.19 47.5,107.19 | 47.5,107.19 47.75,107.19 | 47.5,107.19 49.15,107.19 49.66,106.68 v51.05,106.68
G16  (via drill 0.5 pad 0.8)
  Top 0.406: ULN6.8 v51.05,102.87
  Bottom 0.305: CON1.P$128 33.62,121.51 31.75,119.63 31.75,109.35 35.81,105.28 47.24,105.28 49.66,102.87 v51.05,102.87
G17  (via drill 0.5 pad 0.8)
  Top 0.406: ULN7.3 v51.05,96.77
  Bottom 0.305: CON1.P$122 33.73,126.31 29.84,122.43 29.84,108.58 35.05,103.38 43.05,103.38 49.66,96.77 v51.05,96.77
G18  (via drill 0.5 pad 0.8)
  Top 0.406: ULN7.6 v51.05,92.96
  Bottom 0.305: CON1.P$116 32.3,131.11 27.94,126.75 27.94,107.82 34.29,101.47 41.15,101.47 49.66,92.96 v51.05,92.96
G19  (via drill 0.5 pad 0.8)
  Top 0.406: 50.59,87.59 47.5,90.68 47.5,123.7 4.32,166.88 v3.81,166.88 | 50.59,87.59 50.83,87.34 | ULN8.1 51.31,86.87 50.59,87.59
  Bottom 0.406: CON2.P$8 26.89,161.51 29.97,164.59 29.97,173.48 28.19,175.26 13.21,175.26 4.83,166.88 v3.81,166.88
G20  (via drill 0.5 pad 0.8)
  Top 0.406: v3.81,163.07 4.32,163.07 45.21,122.17 45.21,89.15 51.31,83.06 ULN8.4
  Bottom 0.406: CON2.P$3 27.08,165.51 27.69,166.12 27.69,171.96 26.67,172.97 14.73,172.97 4.83,163.07 v3.81,163.07
G21  (via drill 0.5 pad 0.8)
  Top 0.406: v3.81,159.23 4.34,159.23 42.93,120.65 42.93,87.63 51.31,79.25 ULN8.7
  Bottom 0.406: v3.81,159.23 3.84,159.26 4.83,159.26 11.08,165.51 CON2.P$73
G22  (via drill 0.5 pad 0.8)
  Top 0.406: v3.81,155.45 4.32,155.45 40.64,119.13 40.64,83.82 51.31,73.15 ULN9.2
  Bottom 0.406: CON2.P$77 11.69,162.31 4.83,155.45 v3.81,155.45
G23  (via drill 0.5 pad 0.8)
  Top 0.406: v3.81,151.64 4.32,151.64 36.07,119.89 36.07,84.58 51.31,69.34 ULN9.5
  Bottom 0.406: CON2.P$82 11.5,158.31 4.83,151.64 v3.81,151.64
G24  (via drill 0.5 pad 0.8)
  Top 0.406: v3.81,147.83 4.32,147.83 33.78,118.36 33.78,83.06 51.31,65.53 ULN9.8
  Bottom 0.406: CON2.P$86 12.11,155.11 4.83,147.83 v3.81,147.83
G25  (via drill 0.5 pad 0.8)
  Top 0.406: v3.81,144.02 4.32,144.02 31.5,116.84 31.5,79.25 51.31,59.44 ULN10.3
  Bottom 0.406: CON2.P$91 11.92,151.11 4.83,144.02 v3.81,144.02
G26  (via drill 0.5 pad 0.8)
  Top 0.406: v3.81,140.21 4.32,140.21 29.21,115.32 29.21,77.72 51.31,55.63 ULN10.6
  Bottom 0.406: CON2.P$95 12.53,147.91 4.83,140.21 v3.81,140.21
G27  (via drill 0.5 pad 0.8)
  Top 0.406: v3.81,136.4 4.32,136.4 26.92,113.79 26.92,73.91 51.31,49.53 ULN11.1
  Bottom 0.406: CON2.P$100 12.34,143.91 4.83,136.4 v3.81,136.4
G28  (via drill 0.5 pad 0.8)
  Top 0.406: v3.81,132.59 4.32,132.59 24.64,112.27 24.64,72.39 51.31,45.72 ULN11.4
  Bottom 0.406: CON2.P$104 12.95,140.71 4.83,132.59 v3.81,132.59
G29  (via drill 0.5 pad 0.8)
  Top 0.406: v3.81,128.78 4.32,128.78 20.07,113.03 20.07,73.15 51.31,41.91 ULN11.7
  Bottom 0.406: CON2.P$109 12.76,136.71 4.83,128.78 v3.81,128.78
G30  (via drill 0.5 pad 0.8)
  Top 0.406: v3.81,124.97 4.32,124.97 17.78,111.51 17.78,69.34 51.31,35.81 ULN12.2
  Bottom 0.406: CON2.P$113 13.37,133.51 4.83,124.97 v3.81,124.97
G31  (via drill 0.5 pad 0.8)
  Top 0.406: v3.81,121.16 4.32,121.16 15.49,109.98 15.49,67.82 51.31,32 ULN12.5
  Bottom 0.406: CON2.P$118 13.18,129.51 4.83,121.16 v3.81,121.16
G32  (via drill 0.5 pad 0.8)
  Top 0.406: v3.81,117.35 4.32,117.35 13.21,108.46 13.21,66.29 51.31,28.19 ULN12.8
  Bottom 0.406: CON2.P$122 13.79,126.31 4.83,117.35 v3.81,117.35
G33  (via drill 0.5 pad 0.8)
  Top 0.406: v3.81,113.54 4.32,113.54 10.92,106.93 10.92,62.48 51.31,22.1 ULN13.3
  Bottom 0.406: CON2.P$127 13.6,122.31 4.83,113.54 v3.81,113.54
G34  (via drill 0.5 pad 0.8)
  Top 0.406: v3.81,109.73 4.32,109.73 8.64,105.41 8.64,60.96 51.31,18.29 ULN13.6
  Bottom 0.406: CON2.P$131 14.21,119.11 4.83,109.73 v3.81,109.73
G35  (via drill 0.5 pad 0.8)
  Top 0.406: v3.81,105.92 4.32,105.92 6.35,103.89 6.35,57.15 51.31,12.19 ULN14.1
  Bottom 0.406: CON2.P$136 14.02,115.11 4.83,105.92 v3.81,105.92
G36  (via drill 0.5 pad 0.8)
  Top 0.406: v3.81,102.11 4.06,101.85 4.06,55.63 51.31,8.38 ULN14.4
  Bottom 0.406: CON2.P$140 14.63,111.91 4.83,102.11 v3.81,102.11
GND  (via drill 0.5 pad 0.8)  (231 unrouted)
  other vias: 89.66,78.99 95.76,80.52 38.35,95.25 38.35,93.73 38.35,92.2 38.35,90.68 38.35,89.15 38.35,87.63 38.35,86.11 23.11,101.6 23.11,100.08 23.11,98.55 23.11,97.03 23.11,95.5 23.11,93.98 23.11,92.46 23.11,90.93 23.11,89.41 23.11,87.88 23.11,86.36 50.55,89.15 68.07,88.39 69.6,88.39 71.12,88.39 86.61,91.95 88.14,91.95 89.66,91.95 66.04,113.54 66.04,100.84 50.8,114.05 50.8,126.49 63.75,125.48 50.8,138.94 66.04,138.43 67.31,138.43 49.78,150.88 60.2,150.88 51.05,162.81 57.66,175.51 70.36,175.51 70.36,186.18 119.13,179.07 104.39,172.97 116.08,183.13 137.16,183.13 157.48,183.13 183.9,178.56 185.17,163.58 165.74,170.18 143.76,171.45 122.68,171.45 110.49,138.18 112.01,138.18 113.54,138.18 51.05,76.96 51.05,64.52 51.05,52.07 51.05,39.62 51.05,27.18 51.05,14.73 50.8,4.83 41.4,73.66 35.05,67.56 28.96,61.21 22.61,55.12 16.51,48.77 30.48,148.59 30.48,150.11 30.48,151.64 33.27,177.55 31.75,177.55 30.23,177.55 152.15,138.18 153.67,138.18 155.19,138.18 174.5,138.18 176.02,138.18 177.55,138.18 129.79,90.93 131.32,90.93 132.84,90.93 132.33,45.21 133.86,45.21 135.38,45.21 172.72,45.72 174.24,45.72 175.77,45.72 173.48,8.38 175.01,8.38 176.53,8.38 132.08,7.87 133.6,7.87 135.13,7.87 85.09,6.35 86.61,6.35 88.14,6.35 18.47,19.42 17.39,20.5 16.31,21.58 12.19,178.56 13.72,178.56 15.24,178.56 99.31,171.2 100.84,171.2 102.36,171.2 121.16,167.39 122.68,167.39 124.21,167.39 142.24,165.35 143.76,165.35 145.29,165.35 163.32,162.56 164.85,162.56 166.37,162.56
  pour Top (isolate 0.254): 0,0 0,188.98 199.39,188.98 199.39,0
  pour Bottom (isolate 0.254): 0,0 0,188.98 199.39,188.98 199.39,0
LEVEL_SWITCH_1  (via drill 0.5 pad 0.8)
  Top 0.406: v32.77,167.13 39.12,167.13 41.91,169.93 41.91,175.26 51.31,184.66 53.34,184.66 IC1.1
  Bottom 0.406: CON1.P$71 33.04,167.11 33.02,167.13 v32.77,167.13
LEVEL_SWITCH_2  (via drill 0.5 pad 0.8)
  Top 0.406: v32.77,165.86 39.37,165.86 42.93,169.42 42.93,174.75 51.82,183.64 62.48,183.64 64.01,182.12 IC1.3
  Bottom 0.406: CON1.P$73 33.12,165.51 v32.77,165.86
LEVEL_SWITCH_3  (via drill 0.5 pad 0.8)
  Top 0.406: v32.77,164.59 39.62,164.59 43.94,168.91 43.94,174.24 52.32,182.63 60.96,182.63 64.01,179.58 IC1.5
  Bottom 0.406: CON1.P$74 32.88,164.71 v32.77,164.59
LEVEL_SWITCH_4  (via drill 0.5 pad 0.8, 0.5 pad 1)
  Top 0.406: v32.77,163.32 39.88,163.32 44.96,168.4 44.96,173.74 51.31,180.09 v57.66,180.09
  Top 0.61: IC1.9 79.24,178.31 80.52,177.04 v80.52,171.96
  Bottom 0.406: CON1.P$76 32.98,163.11 v32.77,163.32 | v57.66,180.09 60.96,180.09 69.09,171.96 v80.52,171.96
LEVEL_SWITCH_5  (via drill 0.5 pad 0.8, 0.5 pad 1)
  Top 0.406: v32.77,162.05 40.13,162.05 45.97,167.89 45.97,173.23 51.31,178.56 v57.66,178.56
  Top 0.61: IC1.11 79.75,180.85 82.04,178.56 v82.04,171.96
  Bottom 0.406: v82.04,171.96 82.04,171.45 81.53,170.94 68.58,170.94 60.96,178.56 v57.66,178.56 | CON1.P$77 33.02,162.31 v32.77,162.05
LEVEL_SWITCH_6  (via drill 0.5 pad 0.8, 0.5 pad 1)
  Top 0.406: v32.77,160.78 40.39,160.78 46.99,167.39 46.99,172.72 51.31,177.04 v57.66,177.04
  Top 0.61: IC1.13 80.51,183.39 83.57,180.34 v83.57,171.96
  Bottom 0.406: v83.57,171.96 83.57,170.94 82.55,169.93 68.07,169.93 60.96,177.04 v57.66,177.04 | CON1.P$79 32.84,160.71 v32.77,160.78
N$1
  Top 0.406: R1.1 187.96,151.64 185.93,153.67 166.12,153.67 163.07,156.72 146.05,156.72 143,159.77 127.25,159.77 124.21,162.81 108.71,162.81 105.66,165.86 81.03,165.86 72.9,173.99 ULN1.18
N$2
  Top 0.406: R2.1 185.42,149.86 182.63,152.65 165.61,152.65 162.56,155.7 145.54,155.7 142.49,158.75 126.75,158.75 123.7,161.8 108.2,161.8 105.16,164.85 80.77,164.85 72.9,172.72 ULN1.17
N$3
  Top 0.406: R3.1 182.88,149.1 180.34,151.64 165.1,151.64 162.05,154.69 145.03,154.69 141.99,157.73 126.24,157.73 123.19,160.78 107.7,160.78 104.65,163.83 80.52,163.83 72.9,171.45 ULN1.16
N$4  (via drill 0.5 pad 0.8)
  Top 0.406: R3.2 v182.88,144.53
  Bottom 0.406: RGB1.G 183.34,144.07 v182.88,144.53
N$5  (via drill 0.5 pad 0.8)
  Top 0.406: R2.2 v185.42,144.53
  Bottom 0.406: RGB1.B 184.61,143.71 v185.42,144.53
N$6  (via drill 0.5 pad 0.8)
  Top 0.406: R1.2 v187.96,144.53
  Bottom 0.406: RGB1.R 187.15,143.71 v187.96,144.53
N$7
  Top 0.406: R4.1 166.37,148.84 161.54,153.67 144.53,153.67 141.48,156.72 125.73,156.72 122.68,159.77 107.19,159.77 104.14,162.81 80.26,162.81 72.9,170.18 ULN1.15
N$8
  Top 0.406: 160.96,152.65 144.02,152.65 140.97,155.7 125.22,155.7 122.17,158.75 106.68,158.75 103.63,161.8 80.01,161.8 72.9,168.91 ULN1.14 | 160.96,152.65 161.04,152.65 | 160.96,152.65 163.83,149.78 R5.1
N$9
  Top 0.406: R6.1 161.29,150.37 160.02,151.64 143.51,151.64 140.46,154.69 124.71,154.69 121.67,157.73 106.17,157.73 103.12,160.78 79.76,160.78 72.9,167.64 ULN1.13
N$10
  Top 0.406: R7.1 144.78,148.84 139.95,153.67 124.21,153.67 121.16,156.72 105.66,156.72 102.62,159.77 79.5,159.77 72.9,166.37 ULN1.12
N$11  (via drill 0.5 pad 0.8)
  Top 0.406: R6.2 v161.29,144.53
  Bottom 0.406: RGB2.G 162.13,143.69 v161.29,144.53
N$12  (via drill 0.5 pad 0.8)
  Top 0.406: R5.2 v163.83,144.53
  Bottom 0.406: RGB2.B 163.4,144.09 v163.83,144.53
N$13  (via drill 0.5 pad 0.8)
  Top 0.406: R4.2 v166.37,144.53
  Bottom 0.406: RGB2.R 165.94,144.09 v166.37,144.53
N$14
  Top 0.406: R8.1 142.24,149.86 139.45,152.65 123.7,152.65 120.65,155.7 105.16,155.7 102.11,158.75 79.25,158.75 72.9,165.1 ULN1.11
N$15
  Top 0.406: R19.1 81.28,130.56 74.93,136.91 74.93,143 71.37,146.56 ULN3.16
N$16
  Top 0.406: R20.1 78.74,131.83 73.91,136.65 73.91,142.75 71.37,145.29 ULN3.15
N$17  (via drill 0.5 pad 0.8)
  Top 0.406: R9.2 v139.7,144.53
  Bottom 0.406: RGB3.G 140.92,143.31 v139.7,144.53
N$18  (via drill 0.5 pad 0.8)
  Top 0.406: R8.2 v142.24,144.53
  Bottom 0.406: RGB3.B 142.19,144.47 v142.24,144.53
N$19  (via drill 0.5 pad 0.8)
  Top 0.406: R7.2 v144.78,144.53
  Bottom 0.406: RGB3.R 144.73,144.47 v144.78,144.53
N$20
  Top 0.406: R21.1 76.2,133.1 72.9,136.4 72.9,142.49 71.37,144.02 ULN3.14
N$21  (via drill 0.5 pad 0.8)
  Top 0.406: R22.1 v102.87,138.18 | ULN3.13 v66.04,142.75
  Bottom 0.406: v102.87,138.18 77.47,138.18 72.9,142.75 v66.04,142.75
N$22  (via drill 0.5 pad 0.8)
  Top 0.406: R23.1 v100.33,136.91 | ULN3.12 v66.04,141.48
  Bottom 0.406: v100.33,136.91 76.2,136.91 71.63,141.48 v66.04,141.48
N$23  (via drill 0.5 pad 0.8)
  Top 0.406: R12.2 v119.38,144.53
  Bottom 0.406: RGB4.G 119.71,144.2 v119.38,144.53
N$24  (via drill 0.5 pad 0.8)
  Top 0.406: R11.2 v121.92,144.53
  Bottom 0.406: RGB4.B 120.98,143.58 v121.92,144.53
N$25  (via drill 0.5 pad 0.8)
  Top 0.406: R10.2 v124.46,144.53
  Bottom 0.406: RGB4.R 123.52,143.58 v124.46,144.53
N$26  (via drill 0.5 pad 0.8)
  Top 0.406: R24.1 v97.79,135.64 | ULN3.11 v66.04,140.21
  Bottom 0.406: v97.79,135.64 74.93,135.64 70.36,140.21 v66.04,140.21
N$27  (via drill 0.5 pad 0.8)
  Top 0.406: R27.2 v119.38,122.94
  Bottom 0.406: RGB9.G 119.71,122.61 v119.38,122.94
N$28  (via drill 0.5 pad 0.8)
  Top 0.406: R26.2 v121.92,122.94
  Bottom 0.406: RGB9.B 120.98,121.99 v121.92,122.94
N$29  (via drill 0.5 pad 0.8)
  Top 0.406: R15.2 v97.79,144.53
  Bottom 0.406: RGB5.G 98.5,143.82 v97.79,144.53
N$30  (via drill 0.5 pad 0.8)
  Top 0.406: R14.2 v100.33,144.53
  Bottom 0.406: RGB5.B 99.77,143.96 v100.33,144.53
N$31  (via drill 0.5 pad 0.8)
  Top 0.406: R13.2 v102.87,144.53
  Bottom 0.406: RGB5.R 102.31,143.96 v102.87,144.53
N$32  (via drill 0.5 pad 0.8)
  Top 0.406: R25.2 v124.46,122.94
  Bottom 0.406: RGB9.R 123.52,121.99 v124.46,122.94
N$33  (via drill 0.5 pad 0.8)
  Top 0.406: R30.2 v140.97,123.19
  Bottom 0.406: RGB10.G 140.92,123.14 v140.97,123.19
N$34  (via drill 0.5 pad 0.8)
  Top 0.406: R29.2 v143.51,123.19
  Bottom 0.406: RGB10.B 142.19,121.87 v143.51,123.19
N$35  (via drill 0.5 pad 0.8)
  Top 0.406: R18.2 v76.2,144.53
  Bottom 0.406: RGB6.G 77.29,143.44 v76.2,144.53
N$36  (via drill 0.5 pad 0.8)
  Top 0.406: R17.2 v78.74,144.53
  Bottom 0.406: RGB6.B 78.56,144.34 v78.74,144.53
N$37  (via drill 0.5 pad 0.8)
  Top 0.406: R16.2 v81.28,144.53
  Bottom 0.406: RGB6.R 81.1,144.34 v81.28,144.53
N$38  (via drill 0.5 pad 0.8)
  Top 0.406: R28.2 v146.05,123.19
  Bottom 0.406: RGB10.R 144.73,121.87 v146.05,123.19
N$39  (via drill 0.5 pad 0.8)
  Top 0.406: R33.2 v161.29,123.19
  Bottom 0.406: RGB11.G 162.13,122.35 v161.29,123.19
N$40  (via drill 0.5 pad 0.8)
  Top 0.406: R32.2 v163.83,123.19
  Bottom 0.406: RGB11.B 163.4,122.76 v163.83,123.19
N$41  (via drill 0.5 pad 0.8)
  Top 0.406: R31.2 v166.37,123.19
  Bottom 0.406: RGB11.R 165.94,122.76 v166.37,123.19
N$42  (via drill 0.5 pad 0.8)
  Top 0.406: R36.2 v182.88,122.94
  Bottom 0.406: RGB12.G 183.34,122.48 v182.88,122.94
N$43  (via drill 0.5 pad 0.8)
  Top 0.406: R35.2 v185.42,122.94
  Bottom 0.406: RGB12.B 184.61,122.12 v185.42,122.94
N$44  (via drill 0.5 pad 0.8)
  Top 0.406: R34.2 v187.96,122.94
  Bottom 0.406: RGB12.R 187.15,122.12 v187.96,122.94
N$45  (via drill 0.5 pad 0.8)
  Top 0.406: R19.2 v81.28,122.94
  Bottom 0.406: RGB7.R 81.1,122.75 v81.28,122.94
N$46  (via drill 0.5 pad 0.8)
  Top 0.406: R20.2 v78.74,122.94
  Bottom 0.406: RGB7.B 78.56,122.75 v78.74,122.94
N$47  (via drill 0.5 pad 0.8)
  Top 0.406: R21.2 v76.2,122.94
  Bottom 0.406: RGB7.G 77.29,121.85 v76.2,122.94
N$48  (via drill 0.5 pad 0.8)
  Top 0.406: R22.2 v102.87,122.94
  Bottom 0.406: RGB8.R 102.31,122.37 v102.87,122.94
N$49  (via drill 0.5 pad 0.8)
  Top 0.406: R23.2 v100.33,122.94
  Bottom 0.406: RGB8.B 99.77,122.37 v100.33,122.94
N$50  (via drill 0.5 pad 0.8)
  Top 0.406: R24.2 v97.79,122.94
  Bottom 0.406: RGB8.G 98.5,122.23 v97.79,122.94
N$51  (via drill 0.5 pad 0.8)
  Top 0.406: R39.2 v182.88,101.6
  Bottom 0.406: RGB13.G 183.34,101.14 v182.88,101.6
N$52  (via drill 0.5 pad 0.8)
  Top 0.406: R38.2 v185.42,101.6
  Bottom 0.406: RGB13.B 184.61,100.79 v185.42,101.6
N$53
  Top 0.406: R9.1 139.7,149.61 137.67,151.64 123.19,151.64 120.14,154.69 104.65,154.69 101.6,157.73 76.71,157.73 72.9,161.54 ULN2.18
N$54
  Top 0.406: R10.1 124.46,148.84 119.63,153.67 104.14,153.67 101.09,156.72 76.45,156.72 72.9,160.27 ULN2.17
N$55
  Top 0.406: R11.1 121.92,149.86 119.13,152.65 103.63,152.65 100.58,155.7 76.2,155.7 72.9,159 ULN2.16
N$56
  Top 0.406: R12.1 119.38,150.88 118.62,151.64 103.12,151.64 100.08,154.69 75.95,154.69 72.9,157.73 ULN2.15
N$57
  Top 0.406: R13.1 102.87,150.37 99.57,153.67 75.69,153.67 72.9,156.46 ULN2.14
N$58
  Top 0.406: R14.1 100.33,150.62 98.3,152.65 75.44,152.65 72.9,155.19 ULN2.13
N$59
  Top 0.406: R15.1 97.79,150.62 96.77,151.64 75.18,151.64 72.9,153.92 ULN2.12
N$60
  Top 0.406: R16.1 81.28,149.35 80.01,150.62 74.93,150.62 72.9,152.65 ULN2.11
N$61
  Top 0.406: R17.1 78.74,148.84 78.49,149.1 ULN3.18
N$62
  Top 0.406: ULN3.17 76.11,147.83 R18.1
N$63  (via drill 0.5 pad 0.8)
  Top 0.406: R37.2 v187.96,101.6
  Bottom 0.406: RGB13.R 187.15,100.79 v187.96,101.6
N$64  (via drill 0.5 pad 0.8)
  Top 0.406: R42.2 v161.29,101.6
  Bottom 0.406: RGB14.G 162.13,100.76 v161.29,101.6
N$65  (via drill 0.5 pad 0.8)
  Top 0.406: R41.2 v163.83,101.6
  Bottom 0.406: RGB14.B 163.4,101.17 v163.83,101.6
N$66  (via drill 0.5 pad 0.8)
  Top 0.406: R40.2 v166.37,101.6
  Bottom 0.406: RGB14.R 165.94,101.17 v166.37,101.6
N$67  (via drill 0.5 pad 0.8)
  Top 0.406: R25.1 v124.46,134.37 | ULN4.18 v66.04,136.65
  Bottom 0.406: v124.46,134.37 73.66,134.37 71.37,136.65 v66.04,136.65
N$68  (via drill 0.5 pad 0.8)
  Top 0.406: R26.1 v121.92,133.1 | ULN4.17 v66.04,135.38
  Bottom 0.406: v121.92,133.1 73.47,133.1 71.19,135.38 v66.04,135.38
N$69  (via drill 0.5 pad 0.8)
  Top 0.406: R27.1 v119.38,131.83 | ULN4.16 v66.04,134.11
  Bottom 0.406: v119.38,131.83 73.53,131.83 71.25,134.11 v66.04,134.11
N$70  (via drill 0.5 pad 0.8)
  Top 0.406: R28.1 v146.05,130.56 | ULN4.15 v66.04,132.84
  Bottom 0.406: v146.05,130.56 73.53,130.56 71.24,132.84 v66.04,132.84
N$71  (via drill 0.5 pad 0.8)
  Top 0.406: R29.1 v143.51,129.29 | ULN4.14 v66.04,131.57
  Bottom 0.406: v143.51,129.29 73.4,129.29 71.12,131.57 v66.04,131.57
N$72  (via drill 0.5 pad 0.8)
  Top 0.406: R30.1 v140.97,128.02 | ULN4.13 v66.04,130.3
  Bottom 0.406: v140.97,128.02 73.23,128.02 70.95,130.3 v66.04,130.3
N$73  (via drill 0.5 pad 0.8)
  Top 0.406: R31.1 v166.37,133.1 | ULN4.12 v66.04,129.03
  Bottom 0.406: v166.37,133.1 158.75,133.1 152.4,126.75 73.09,126.75 70.8,129.03 v66.04,129.03
N$74  (via drill 0.5 pad 0.8)
  Top 0.406: R32.1 v163.83,131.83 | ULN4.11 v66.04,127.76
  Bottom 0.406: v163.83,131.83 160.02,131.83 153.67,125.48 72.89,125.48 70.61,127.76 v66.04,127.76
N$75  (via drill 0.5 pad 0.8)
  Top 0.406: R33.1 v161.29,130.56 | ULN5.18 v66.04,124.21
  Bottom 0.406: 155.12,124.39 154.94,124.21 | 155.12,124.39 v161.29,130.56 | v66.04,124.21 154.94,124.21 | 154.94,124.21 155.12,124.39
N$76
  Top 0.406: R34.1 188.38,126.75 189.23,126.75 190.5,125.48 190.5,120.4 187.96,117.86 74.93,117.86 69.85,122.94 ULN5.17
N$77
  Top 0.406: R35.1 185.42,126.75 186.69,128.02 189.23,128.02 191.77,125.48 191.77,120.4 187.96,116.59 74.93,116.59 69.85,121.67 ULN5.16
N$78
  Top 0.406: R36.1 182.88,128.02 184.15,129.29 189.23,129.29 193.04,125.48 193.04,120.4 187.96,115.32 74.93,115.32 69.85,120.4 ULN5.15
N$79
  Top 0.406: 71.15,117.83 71.12,117.86 | 71.15,117.83 74.93,114.05 184.15,114.05 187.96,110.24 R37.1 | ULN5.14 69.85,119.13 71.15,117.83
N$80
  Top 0.406: R38.1 185.42,108.97 181.61,112.78 74.93,112.78 69.85,117.86 ULN5.13
N$81
  Top 0.406: R39.1 182.88,107.7 179.07,111.51 74.93,111.51 69.85,116.59 ULN5.12
N$82
  Top 0.406: 71.28,113.89 71.12,114.05 | 71.28,113.89 74.93,110.24 163.83,110.24 166.37,107.7 R40.1 | ULN5.11 69.85,115.32 71.28,113.89
N$83
  Top 0.406: R41.1 163.83,106.43 161.29,108.97 74.93,108.97 72.14,111.76 ULN6.18
N$84
  Top 0.406: R42.1 161.29,106.43 160.02,107.7 74.93,107.7 72.14,110.49 ULN6.17
N$85
  Top 0.406: R43.1 144.78,105.16 143.51,106.43 74.93,106.43 72.14,109.22 ULN6.16
N$86
  Top 0.406: R44.1 138.85,105.16 74.93,105.16 72.14,107.95 ULN6.15
N$87
  Top 0.406: R45.1 140.55,93.73 138.43,93.73 137.16,95 137.16,101.35 134.62,103.89 74.93,103.89 72.14,106.68 ULN6.14
N$88  (via drill 0.5 pad 0.8)
  Top 0.406: R46.1 v124.46,92.46 | ULN6.13 v66.04,105.41
  Bottom 0.406: v66.04,105.41 66.29,105.41 66.8,104.9 122.17,104.9 126.24,100.84 126.24,94.23 v124.46,92.46
N$89  (via drill 0.5 pad 0.8)
  Top 0.406: R47.1 v121.92,92.46 | ULN6.12 v66.04,104.14
  Bottom 0.406: v66.04,104.14 66.29,103.89 109.98,103.89 120.65,93.22 120.65,92.96 121.16,92.46 v121.92,92.46
N$90  (via drill 0.5 pad 0.8)
  Top 0.406: R48.1 v119.38,92.46 | ULN6.11 v66.04,102.87
  Bottom 0.406: v66.04,102.87 108.97,102.87 v119.38,92.46
N$91  (via drill 0.5 pad 0.8)
  Top 0.406: R43.2 v144.78,101.6
  Bottom 0.406: RGB15.R 144.73,101.55 v144.78,101.6
N$92  (via drill 0.5 pad 0.8)
  Top 0.406: R44.2 141.82,102.78 v142.24,102.36
  Bottom 0.406: RGB15.B 142.19,102.31 v142.24,102.36
N$93  (via drill 0.5 pad 0.8)
  Top 0.406: R45.2 v140.97,97.03
  Bottom 0.406: RGB15.G 140.92,97.08 v140.97,97.03
N$94  (via drill 0.5 pad 0.8)
  Top 0.406: R46.2 v124.46,97.03
  Bottom 0.406: RGB16.R 123.52,97.97 v124.46,97.03
N$95  (via drill 0.5 pad 0.8)
  Top 0.406: R47.2 v121.92,97.03
  Bottom 0.406: RGB16.B 120.98,97.97 v121.92,97.03
N$96  (via drill 0.5 pad 0.8)
  Top 0.406: R48.2 v119.38,97.03
  Bottom 0.406: RGB16.G 119.71,97.36 v119.38,97.03
N$97  (via drill 0.5 pad 0.8)
  Top 0.406: R51.2 v97.79,97.28
  Bottom 0.406: RGB17.G 98.5,97.99 v97.79,97.28
N$98  (via drill 0.5 pad 0.8)
  Top 0.406: R50.2 v100.33,97.28
  Bottom 0.406: RGB17.B 99.77,97.84 v100.33,97.28
N$99  (via drill 0.5 pad 0.8)
  Top 0.406: R49.2 v102.87,97.28
  Bottom 0.406: RGB17.R 102.31,97.84 v102.87,97.28
N$100  (via drill 0.5 pad 0.8)
  Top 0.406: R54.2 v76.2,97.28
  Bottom 0.406: RGB18.G 77.29,98.37 v76.2,97.28
N$101  (via drill 0.5 pad 0.8)
  Top 0.406: R53.2 v78.74,97.28
  Bottom 0.406: RGB18.B 78.56,97.47 v78.74,97.28
N$102  (via drill 0.5 pad 0.8)
  Top 0.406: R52.2 v81.28,97.28
  Bottom 0.406: RGB18.R 81.1,97.47 v81.28,97.28
N$103  (via drill 0.5 pad 0.8)
  Top 0.406: R57.2 v76.2,80.52
  Bottom 0.406: RGB19.G 77.29,79.43 v76.2,80.52
N$104  (via drill 0.5 pad 0.8)
  Top 0.406: R56.2 v78.74,80.52
  Bottom 0.406: RGB19.B 78.56,80.33 v78.74,80.52
N$105  (via drill 0.5 pad 0.8)
  Top 0.406: R55.2 v81.28,80.52
  Bottom 0.406: RGB19.R 81.1,80.33 v81.28,80.52
N$106  (via drill 0.5 pad 0.8)
  Top 0.406: R60.2 v97.79,81.03
  Bottom 0.406: RGB20.G 98.5,80.32 v97.79,81.03
N$107  (via drill 0.5 pad 0.8)
  Top 0.406: R59.2 v100.33,81.03
  Bottom 0.406: RGB20.B 99.77,80.46 v100.33,81.03
N$108  (via drill 0.5 pad 0.8)
  Top 0.406: R58.2 v102.87,81.03
  Bottom 0.406: RGB20.R 102.31,80.46 v102.87,81.03
N$109  (via drill 0.5 pad 0.8)
  Top 0.406: R63.2 v119.38,81.03
  Bottom 0.406: RGB21.G 119.71,80.7 v119.38,81.03
N$110  (via drill 0.5 pad 0.8)
  Top 0.406: R62.2 v121.92,81.03
  Bottom 0.406: RGB21.B 120.98,80.08 v121.92,81.03
N$111  (via drill 0.5 pad 0.8)
  Top 0.406: R61.2 v124.46,81.03
  Bottom 0.406: RGB21.R 123.52,80.08 v124.46,81.03
N$112  (via drill 0.5 pad 0.8)
  Top 0.406: R66.2 v140.97,81.28
  Bottom 0.406: RGB22.G 140.92,81.23 v140.97,81.28
N$113  (via drill 0.5 pad 0.8)
  Top 0.406: R65.2 v143.51,81.28
  Bottom 0.406: RGB22.B 142.19,79.96 v143.51,81.28
N$114  (via drill 0.5 pad 0.8)
  Top 0.406: R64.2 v146.05,81.28
  Bottom 0.406: RGB22.R 144.73,79.96 v146.05,81.28
N$115
  Top 0.406: 68.81,100.31 68.29,99.79 | 68.81,100.31 71.12,102.62 102.87,102.62 105.41,100.08 105.41,95 104.14,93.73 103.29,93.73 R49.1 | ULN7.18 67.82,99.31 68.81,100.31
N$116
  Top 0.406: R50.1 100.33,92.71 99.06,91.44 96.77,91.44 94.49,93.73 94.49,100.58 93.22,101.85 71.63,101.85 67.82,98.04 ULN7.17
N$117  (via drill 0.5 pad 0.8)
  Top 0.406: v97.79,92.46 R51.1 | ULN7.16 v66.04,96.77
  Bottom 0.406: v66.04,96.77 71.12,96.77 75.69,101.35 88.9,101.35 v97.79,92.46
N$118  (via drill 0.5 pad 0.8)
  Top 0.406: v81.28,92.71 R52.1 | ULN7.15 v66.04,95.5
  Bottom 0.406: v81.28,92.71 78.49,95.5 v66.04,95.5
N$119  (via drill 0.5 pad 0.8)
  Top 0.406: v78.74,92.71 R53.1 | ULN7.14 v66.04,94.23
  Bottom 0.406: v66.04,94.23 77.22,94.23 v78.74,92.71
N$120
  Top 0.406: 75.77,93.71 75.49,93.44 | 75.77,93.71 R54.1 | ULN7.13 75.02,92.96 75.77,93.71
N$121
  Top 0.406: R55.1 81.28,85.85 75.44,91.69 ULN7.12
N$122
  Top 0.406: R56.1 78.74,86.61 74.93,90.42 ULN7.11
N$123
  Top 0.406: 75.43,86.63 74.71,87.34 | 75.43,86.63 76.2,85.85 R57.1 | ULN8.18 75.18,86.87 75.43,86.63
N$124  (via drill 0.5 pad 0.8)
  Top 0.406: R58.1 v102.87,86.11 | ULN8.17 v66.04,85.6
  Bottom 0.406: 93.68,86.31 93.47,86.11 | 93.68,86.31 96.01,88.65 101.35,88.65 102.87,87.12 v102.87,86.11 | v66.04,85.6 92.96,85.6 93.68,86.31
N$125  (via drill 0.5 pad 0.8)
  Top 0.406: R59.1 v100.33,86.11 | ULN8.16 v66.04,84.33
  Bottom 0.406: 94.19,85.3 93.73,84.84 | 94.19,85.3 96.52,87.63 98.81,87.63 v100.33,86.11 | v66.04,84.33 93.22,84.33 94.19,85.3
N$126  (via drill 0.5 pad 0.8)
  Top 0.406: R60.1 v97.79,86.11 | ULN8.15 v66.04,83.06
  Bottom 0.406: v66.04,83.06 94.74,83.06 v97.79,86.11
N$127  (via drill 0.5 pad 0.8)
  Top 0.406: R61.1 v124.46,86.11 | ULN8.14 v66.04,81.79
  Bottom 0.406: 105.68,82.56 105.41,82.3 | 105.68,82.56 111.51,88.39 122.17,88.39 v124.46,86.11 | v66.04,81.79 75.62,81.79 75.66,81.83 96.56,81.83 97.03,82.3 105.41,82.3 | 105.41,82.3 105.68,82.56
N$128  (via drill 0.5 pad 0.8)
  Top 0.406: R62.1 v121.92,86.11 | ULN8.13 v66.04,80.52
  Bottom 0.406: v121.92,86.11 120.65,87.38 111.76,87.38 104.65,80.26 104.65,77.72 102.87,75.95 97.79,75.95 97.28,76.45 76.2,76.45 72.14,80.52 v66.04,80.52
N$129  (via drill 0.5 pad 0.8)
  Top 0.406: R63.1 v119.38,86.11 | ULN8.12 v66.04,79.25
  Bottom 0.406: 77.68,75.44 77.47,75.44 | 77.68,75.44 96.77,75.44 97.28,74.93 103.38,74.93 105.92,77.47 105.92,80.01 112.01,86.11 v119.38,86.11 | v66.04,79.25 71.88,79.25 75.69,75.44 77.68,75.44
N$130  (via drill 0.5 pad 0.8)
  Top 0.406: R64.1 v146.05,86.36 | ULN8.11 v66.04,77.98
  Bottom 0.406: 77.76,74.42 76.96,74.42 | 77.76,74.42 96.27,74.42 96.77,73.91 123.44,73.91 137.92,88.39 144.02,88.39 v146.05,86.36 | v66.04,77.98 71.63,77.98 75.18,74.42 77.76,74.42
N$131  (via drill 0.5 pad 0.8)
  Top 0.406: R65.1 v143.51,86.36 | ULN9.18 v66.04,74.42
  Bottom 0.406: v143.51,86.36 142.49,87.38 138.43,87.38 123.95,72.9 96.27,72.9 95.76,73.41 74.68,73.41 73.66,74.42 v66.04,74.42
N$132  (via drill 0.5 pad 0.8)
  Top 0.406: R66.1 v140.97,86.36 | ULN9.17 v66.04,73.15
  Bottom 0.406: v140.97,86.36 138.94,86.36 124.46,71.88 95.76,71.88 95.25,72.39 74.17,72.39 73.41,73.15 v66.04,73.15
N$133  (via drill 0.5 pad 0.8)
  Top 0.406: R67.1 v166.37,86.61 | ULN9.16 v66.04,71.88
  Bottom 0.406: 75.98,71.37 75.69,71.37 | 75.98,71.37 94.74,71.37 95.25,70.87 141.73,70.87 159.51,88.65 164.59,88.65 166.37,86.87 v166.37,86.61 | v66.04,71.88 73.15,71.88 73.66,71.37 75.98,71.37
N$134  (via drill 0.5 pad 0.8)
  Top 0.406: R68.1 v163.83,86.61 | ULN9.15 v66.04,70.61
  Bottom 0.406: v163.83,86.61 162.81,87.63 160.02,87.63 142.24,69.85 73.66,69.85 72.9,70.61 v66.04,70.61
N$135  (via drill 0.5 pad 0.8)
  Top 0.406: R69.1 v161.29,86.61 | ULN9.14 v66.04,69.34
  Bottom 0.406: 95.52,68.83 94.23,68.83 | 95.52,68.83 142.75,68.83 160.53,86.61 v161.29,86.61 | v66.04,69.34 72.64,69.34 73.15,68.83 95.52,68.83
N$136  (via drill 0.5 pad 0.8)
  Top 0.406: R70.1 v186.69,86.61 | ULN9.13 v66.04,68.07
  Bottom 0.406: v186.69,86.61 184.66,88.65 180.34,88.65 159.51,67.82 72.9,67.82 72.64,68.07 v66.04,68.07
N$137  (via drill 0.5 pad 0.8)
  Top 0.406: R71.1 v184.15,86.61 | ULN9.12 v66.04,66.8
  Bottom 0.406: v184.15,86.61 183.13,87.63 180.85,87.63 160.02,66.8 v66.04,66.8
N$138  (via drill 0.5 pad 0.8)
  Top 0.406: R72.1 v181.61,86.61 | ULN9.11 v66.04,65.53
  Bottom 0.406: 93.25,65.79 92.96,65.79 | 93.25,65.79 160.53,65.79 181.36,86.61 v181.61,86.61 181.86,86.61 | v66.04,65.53 73.91,65.53 74.17,65.79 93.25,65.79
N$139  (via drill 0.5 pad 0.8)
  Top 0.406: R67.2 v166.37,81.03
  Bottom 0.406: RGB23.R 165.94,80.59 v166.37,81.03